# Altium project battery capacity measure.PrjPcb
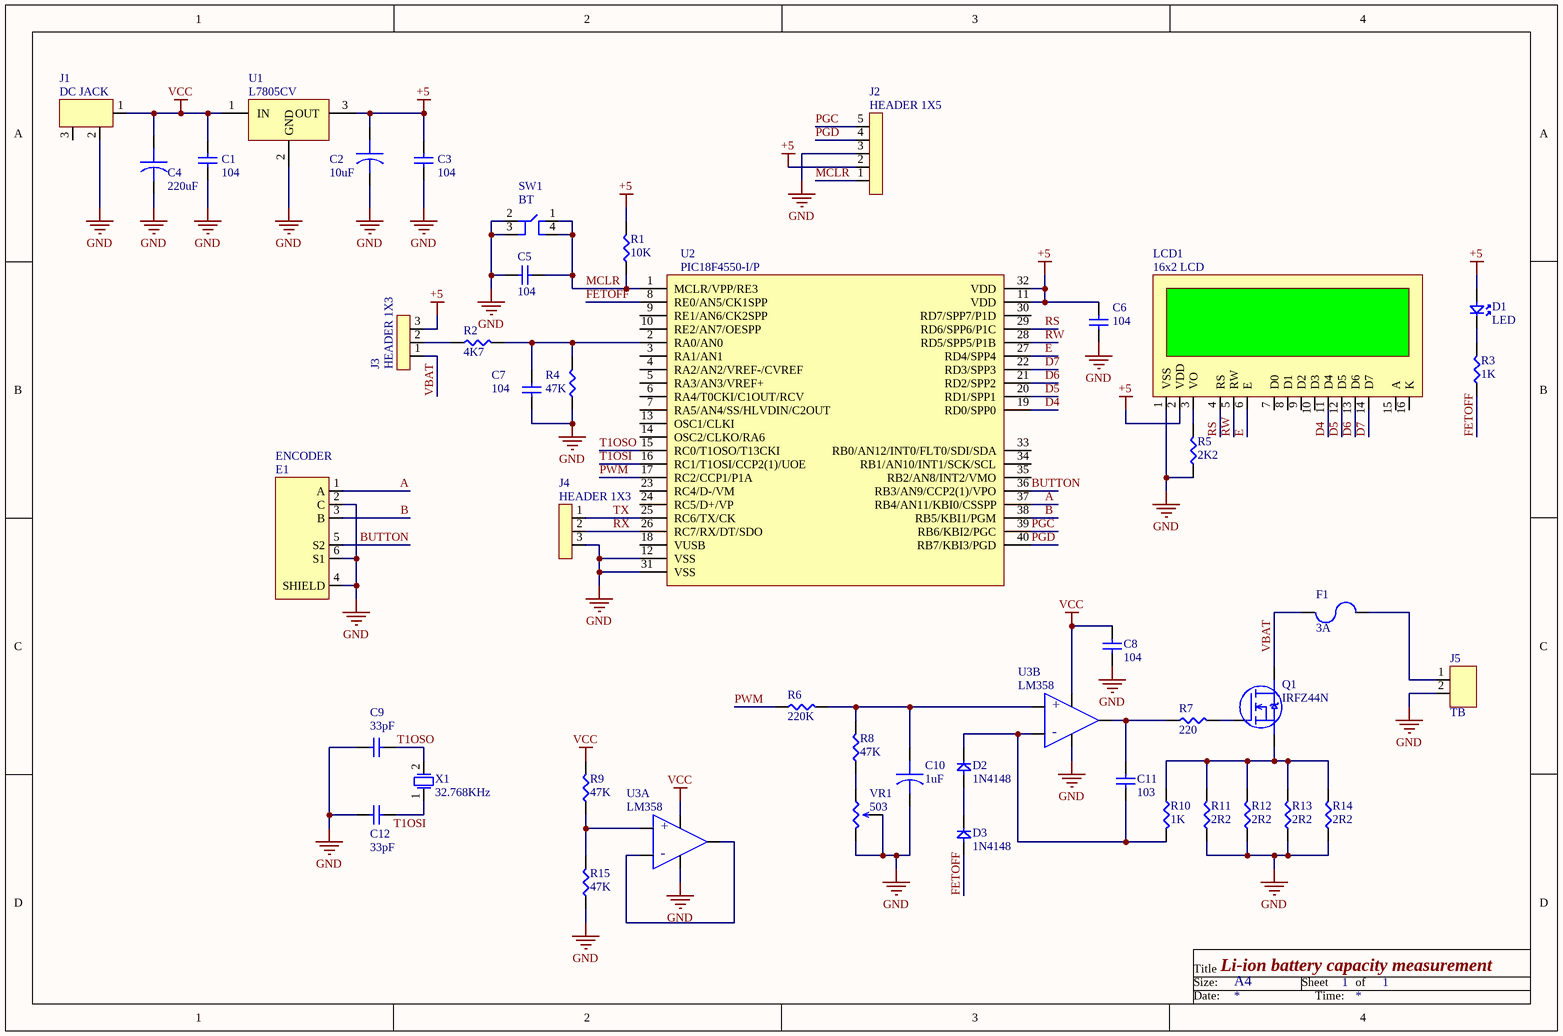
[diagram p0: SCH.SchDoc]
1 sheet, 45 parts. Net scope: global (net labels, ports and power ports of the same name join across sheets).
Board file: PCB.PcbDoc

## Sheet SCH.SchDoc
size A4

### Parts
C1  104  [CAP CER 2.5]
C2  10uF  [CPOL TH 2x5.08mm]
C3  104  [CAP CER 2.5]
C4  220uF  [CPOL TH 3.5x8.01mm]
C5  104  [CAP CER 2.5]
C6  104  [CAP CER 2.5]
C7  104  [CAP CER 2.5]
C8  104  [CAP CER 2.5]
C9  33pF  [CAP CER 2.5]
C10  1uF  [CPOL TH 2x5.08mm]
C11  103  [CAP CER 2.5]
C12  33pF  [CAP CER 2.5]
D1  LED  [LED TH 5MM]
D2  1N4148  [DO-35]
D3  1N4148  [DO-35]
E1  ENCODER  [ENCODER]
F1  3A  [FUSE 5X20MM]
J1  DC JACK  [DC JACK 5MM]
J2  HEADER 1X5  [HEADER 1X5]
J3  HEADER 1X3  [HEADER 1X3]
J4  HEADER 1X3  [HEADER 1X3]
J5  TB  [TBLOCK-I2]
LCD1  16x2 LCD  [16 X 2 LCD]
Q1  IRFZ44N  [TO-220]
R1  10K  [RES TH 1/4W]
R2  4K7  [RES TH 1/4W]
R3  1K  [RES TH 1/4W]
R4  47K  [RES TH 1/4W]
R5  2K2  [RES TH 1/4W]
R6  220K  [RES TH 1/4W]
R7  220  [RES TH 1/4W]
R8  47K  [RES TH 1/4W]
R9  47K  [RES TH 1/4W]
R10  1K  [RES TH 1/4W]
R11  2R2  [RES TH 1W]
R12  2R2  [RES TH 1W]
R13  2R2  [RES TH 1W]
R14  2R2  [RES TH 1W]
R15  47K  [RES TH 1/4W]
SW1  BT  [BUTTON 6X6]
U1  L7805CV  [TO-220]
U2  PIC18F4550-I/P  [DIP 40]
U3  LM358  [DIP 8]  (parts A,B of 2)
VR1  503  [3296W]
X1  32.768KHz  [TUNING FORK]

### Nets
+5: C2.1(+) C3.1 C6.1 D1.1(A) J2.2 J3.3 LCD1.2(VDD) R1.2 U1.3(OUT) U2.11(VDD) U2.32(VDD)
GND: C1.2 C2.2(-) C3.2 C4.2(-) C5.1 C6.2 C7.2 C8.2 C9.1 C10.2(-) C12.1 E1.2(C) E1.4(SHIELD) E1.6(S1) J1.2 J2.3 J4.3 J5.2 LCD1.1(VSS) R4.1 R5.1 R11.1 R12.1 R13.1 R14.1 R15.1 SW1.2 SW1.3 U1.2(GND) U2.12(VSS) U2.31(VSS) U3.4(V-) VR1.2 VR1.3
VCC: C1.1 C4.1(+) C8.1 J1.1 R9.2 U1.1(IN) U3.8(V+)
A: E1.1(A) U2.37(RB4/AN11/KBI0/CSSPP)
B: E1.3(B) U2.38(RB5/KBI1/PGM)
BUTTON: E1.5(S2) U2.36(RB3/AN9/CCP2(1)/VPO)
D4: LCD1.11(D4) U2.19(RD0/SPP0)
D5: LCD1.12(D5) U2.20(RD1/SPP1)
D6: LCD1.13(D6) U2.21(RD2/SPP2)
D7: LCD1.14(D7) U2.22(RD3/SPP3)
E: LCD1.6(E) U2.27(RD4/SPP4)
FETOFF: D3.1(A) R3.1 U2.8(RE0/AN5/CK1SPP)
MCLR: C5.2 J2.1 R1.1 SW1.1 SW1.4 U2.1(MCLR/VPP/RE3)
PGC: J2.5 U2.39(RB6/KBI2/PGC)
PGD: J2.4 U2.40(RB7/KBI3/PGD)
PWM: R6.1 U2.17(RC2/CCP1/P1A)
RS: LCD1.4(RS) U2.29(RD6/SPP6/P1C)
RW: LCD1.5(RW) U2.28(RD5/SPP5/P1B)
RX: J4.2 U2.26(RC7/RX/DT/SDO)
T1OSI: C12.2 U2.16(RC1/T1OSI/CCP2(1)/UOE) X1.1
T1OSO: C9.2 U2.15(RC0/T1OSO/T13CKI) X1.2
TX: J4.1 U2.25(RC6/TX/CK)
VBAT: F1.1 J3.1 Q1.2(D)
NetC7_1: C7.1 R2.2 R4.2 U2.2(RA0/AN0)
NetC10_1: C10.1(+) R6.2 R8.2 U3.5(+INB)
NetC11_1: C11.1 R7.1 U3.7(OUTB)
NetC11_2: C11.2 D2.2(K) R10.2 U3.6(-INB)
NetD1_2: D1.2(K) R3.2
NetD2_1: D2.1(A) D3.2(K)
NetF1_2: F1.2 J5.1
NetJ3_2: J3.2 R2.1
NetLCD1_3: LCD1.3(VO) R5.2
NetQ1_1: Q1.1(G) R7.2
NetQ1_3: Q1.3(S) R10.1 R11.2 R12.2 R13.2 R14.2
NetR8_1: R8.1 VR1.1
NetR9_1: R9.1 R15.2 U3.3(+INA)
NetU3_1: U3.1(OUTA) U3.2(-INA)

Not connected (* = marked no-connect by the designer): J1 3; LCD1 7(D0) 8(D1) 9(D2) 10(D3) 15(A) 16(K); U2 3(RA1/AN1) 4(RA2/AN2/VREF-/CVREF) 5(RA3/AN3/VREF+) 6(RA4/T0CKI/C1OUT/RCV) 7(RA5/AN4/SS/HLVDIN/C2OUT) 9(RE1/AN6/CK2SPP) 10(RE2/AN7/OESPP) 13(OSC1/CLKI) 14(OSC2/CLKO/RA6) 18(VUSB) 23(RC4/D-/VM) 24(RC5/D+/VP) 30(RD7/SPP7/P1D) 33(RB0/AN12/INT0/FLT0/SDI/SDA) 34(RB1/AN10/INT1/SCK/SCL) 35(RB2/AN8/INT2/VMO)

### Notes on the sheet
- Title
- Size:
- Li-ion battery capacity measurement
- A4
- Sheet
- 1
- of
- Date:
- Time:
- (in symbol LM358AN, part A) +; -
- (in symbol LM358AN, part B) +; -

### Library data of the parts
C1 C3 C5-C8 = CAP CER 104: Capacitor;  Ceramic;  Cap 0.1 uF;  Tol -20, +80%;  Vol-Rtg 50 VDC;  Radial;  Y5V; Manufacturer: NTE Electronics; Manufacturer Part Number: 89410; Tolerance: 80%; Capacitance: 100nF; Voltage Rating (DC): 50V; Supplier 1: Newark; RoHS: No; Category: Ceramic Capacitors; Pricing 1: 1=0,23200, 10=0,22300, 25=0,22200, 50=0,22000, 100=0,21300 (USD); Mount: Through Hole; Case/Package: Radial; Min Operating Temperature: -25°C; Max Operating Temperature: 85°C; Termination: Radial; Resistor Type: Ceramic; Lead Pitch: 4.5mm; ComponentLink1URL: https://datasheet.ciiva.com/14590/70232643-14590315.pdf?src-supplier=Allied+Electronics; ComponentLink1Description: https://datasheet.ciiva.com/14590/70232643-14590315.pdf?src-supplier=Allied+Electronics; ComponentLink2URL: https://datasheet.ciiva.com/15915/5989000-15915839.pdf?src-supplier=Onlinecomponents.com; ComponentLink2Description: https://datasheet.ciiva.com/15915/5989000-15915839.pdf?src-supplier=Onlinecomponents.com; Supplier Part Number 1: 33C9034
C2 = CPOL TH 10uF 50V: Aluminum Electrolytic Capacitors - Leaded 50volts 10uF 20%; Manufacturer: KEMET; Manufacturer Part Number: ESH106M050AC3AA; Dielectric Material: Aluminium; Voltage Rating (DC): 50V; Ripple Current: 50mA; Polarity: Polar; Life (Hours): 2000Hour; Leakage Current: 5uA; Dissipation Factor: 12%; Lead Diameter: 0.5mm; Lead Length: 20mm; Supplier 1: Digi-Key; RoHS: Yes; Category: Aluminum Electrolytic Capacitors; Stock 1: 5452; Pricing 1: 1=0,22000, 10=0,14900, 50=0,08960, 100=0,07560, 500=0,05172, 1000=0,04576, 2500=0,04377, 5000=0,03979 (USD); Mount: Through Hole,PCB; Case/Package: Radial; Min Operating Temperature: -40°C; Max Operating Temperature: 105°C; Capacitance: 10uF; Tolerance: 20%; Voltage Rating: 50V; Packaging: Bulk; Package Quantity: 10000; Termination: Radial; Voltage: 50V; Series: ESH; Diameter: 5mm; Length: 11mm; Height: 11mm; Lead Pitch: 2mm; Height - Seated (Max): 0.492inch; Radiation Hardening: No; REACH SVHC: No SVHC; RoHS Compliant: Yes; ComponentLink1URL: https://datasheet.ciiva.com/18447/70233271-18447125.pdf?src-supplier=Allied+Electronics; ComponentLink1Description: https://datasheet.ciiva.com/18447/70233271-18447125.pdf?src-supplier=Allied+Electronics; ComponentLink2URL: https://datasheet.ciiva.com/22620/1794402-22620758.pdf?src-supplier=Element14; ComponentLink2Description: https://datasheet.ciiva.com/22620/1794402-22620758.pdf?src-supplier=Element14; Supplier Part Number 1: 399-6543-ND
C4 = CPOL TH 220uF 25V: Cap Aluminum Lytic 220uF 25V 20% (8 X 11mm) Radial 3.5mm 250mA 2000h 105C Bulk; Manufacturer: KEMET; Manufacturer Part Number: ESH227M025AG3AA; Dielectric Material: Aluminium; Life (Hours): 2000Hour; Leakage Current: 55uA; Dissipation Factor: 16%; Lead Diameter: 0.6mm; Lead Length: 20mm; Supplier 1: Digi-Key; RoHS: Yes; Category: Aluminum Electrolytic Capacitors; Stock 1: 18483; Pricing 1: 1=0,37000, 10=0,25500, 50=0,17020, 100=0,14470, 500=0,10212, 1000=0,08936, 2500=0,08510, 5000=0,07872 (USD); Mount: Through Hole,PCB; Case/Package: Radial; Min Operating Temperature: -40°C; Max Operating Temperature: 105°C; Capacitance: 220uF; Tolerance: 20%; Ripple Current: 250mA; Voltage Rating: 25V; Packaging: Bulk; Voltage Rating (DC): 25V; Package Quantity: 6000; Termination: Radial; Voltage: 25V; Series: ESH; Diameter: 8mm; Length: 11mm; Height: 11mm; Lead Pitch: 3.5mm; Height - Seated (Max): 0.492inch; Radiation Hardening: No; REACH SVHC: No SVHC; RoHS Compliant: Yes; ComponentLink1URL: https://datasheet.ciiva.com/22627/1794402-22627034.pdf?src-supplier=Farnell; ComponentLink1Description: https://datasheet.ciiva.com/22627/1794402-22627034.pdf?src-supplier=Farnell; Supplier Part Number 1: 399-6567-ND
C9 C12 = CAP CER 33pF: CAPACITOR CERAMIC DISC 10000PF 50V 10% RADIAL LEAD; Manufacturer: NTE Electronics; Manufacturer Part Number: 89033; Supplier 1: Onlinecomponents.com; RoHS: No; Category: Ceramic Capacitors; Stock 1: 9; Pricing 1: 80=1,86600, 100=0,80600, 250=0,40800, 500=0,39000 (USD); Mount: Through Hole; Case/Package: Radial; Min Operating Temperature: -25°C; Max Operating Temperature: 85°C; Tolerance: 10%; Capacitance: 33pF; Resistor Type: Ceramic; Lead Pitch: 2.5mm; ComponentLink1URL: https://datasheet.ciiva.com/15915/5989000-15915132.pdf?src-supplier=Onlinecomponents.com; ComponentLink1Description: https://datasheet.ciiva.com/15915/5989000-15915132.pdf?src-supplier=Onlinecomponents.com; Supplier Part Number 1: 89033; Voltage Rating (DC): 50V; ComponentLink2URL: https://datasheet.ciiva.com/15915/5989000-15915161.pdf?src-supplier=Onlinecomponents.com; ComponentLink2Description: https://datasheet.ciiva.com/15915/5989000-15915161.pdf?src-supplier=Onlinecomponents.com
C10 = CPOL TH 1uF 50V: Cap Aluminum 1uF 50V 20% (5 X 11mm) Radial Aluminum Cylindrical Can 2mm 12mA 2000 hr 105°C Bulk; Manufacturer: KEMET; Manufacturer Part Number: ESH105M050AC3AA; Dielectric Material: Aluminium; Leakage Current: 3uA; Dissipation Factor: 12%; Life (Hours): 2000Hour; Lead Diameter: 0.5mm; Lead Length: 20mm; Supplier 1: Newark; RoHS: Yes; Category: Aluminum Electrolytic Capacitors; Stock 1: 8232; Pricing 1: 10=0,15000, 25=0,11900, 50=0,08700, 100=0,07300, 500=0,05200, 1000=0,04400, 2500=0,04200 (USD); Mount: Through Hole,PCB; Case/Package: Radial; Min Operating Temperature: -40°C; Max Operating Temperature: 105°C; Capacitance: 1uF; Tolerance: 20%; Ripple Current: 12mA; Packaging: Bulk; Voltage Rating: 50V; Voltage Rating (DC): 50V; Package Quantity: 10000; Termination: Radial; Voltage: 50V; Series: ESH; Diameter: 5mm; Length: 11mm; Height: 11mm; Lead Pitch: 2mm; Height - Seated (Max): 0.492inch; Radiation Hardening: No; RoHS Compliant: Yes; ComponentLink1URL: https://datasheet.ciiva.com/14609/70233271-14609911.pdf?src-supplier=Allied+Electronics; ComponentLink1Description: https://datasheet.ciiva.com/14609/70233271-14609911.pdf?src-supplier=Allied+Electronics; Supplier Part Number 1: 48AC1666
C11 = CAP CER 103: CAPACITOR CERAMIC DISC 10000PF 50V 10% RADIAL LEAD; Manufacturer: NTE Electronics; Manufacturer Part Number: 89310; Capacitance: 10nF; Supplier 1: Onlinecomponents.com; RoHS: No; Category: Ceramic Capacitors; Stock 1: 7; Pricing 1: 70=2,24380, 100=1,30000, 250=0,48500, 500=0,47300 (USD); Mount: Through Hole; Case/Package: Radial; Min Operating Temperature: -25°C; Max Operating Temperature: 85°C; Tolerance: 10%; Voltage Rating (DC): 50V; Resistor Type: Ceramic; Lead Pitch: 5.1mm; ComponentLink1URL: https://datasheet.ciiva.com/15915/5989000-15915161.pdf?src-supplier=Onlinecomponents.com; ComponentLink1Description: https://datasheet.ciiva.com/15915/5989000-15915161.pdf?src-supplier=Onlinecomponents.com; Supplier Part Number 1: 89310
D1 = LED GREEN 5MM: 5MM Yellow Green Led Lamp; Manufacturer: American Opto Plus; Manufacturer Part Number: L513GD-A; Supplier 1: Interstate Connecting Components; Supplier Part Number 1: 557T071M432ST
D2 D3 = 1N4148: DIODE GEN PURP 100V 200MA DO35; Manufacturer: ON Semiconductor / Fairchild; Forward Voltage: 1V; Polarity: Standard; Capacitance: 4pF; Forward Current: 300mA; Reverse Recovery Time: 4ns; Element Configuration: Single; Peak Non-Repetitive Surge Current: 4A; Max Forward Surge Current (Ifsm): 1A; Max Power Dissipation: 500mW; Max Reverse Current: 5uA; Outside Diameter: 1.85mm; Supplier 1: RSComponents; Manufacturer Part Number: 1N4148; RoHS: Yes; Category: Integrated Circuits (ICs); Stock 1: 106000; Pricing 1: 2000=0,02100, 10000=0,02100 (USD); Mount: Through Hole; Case/Package: DO-35; Number of Pins: 2; Weight: 0.01lb; Contact Plating: Tin,Matte; Min Operating Temperature: -65°C; Max Operating Temperature: 175°C; Packaging: Bulk; Current Rating: 200mA; Output Current: 200mA; Max Repetitive Reverse Voltage (Vrrm): 100V; Voltage Rating (DC): 100V; Voltage: 100V; Current: 4A; Package Quantity: 2000; Average Rectified Current: 200mA; Power Dissipation: 500mW; Max Surge Current: 4A; Recovery Time: 4ns; Max Reverse Voltage (DC): 100V; Reverse Voltage: 100V; Series: -; Diameter: 1.91mm; Length: 4.56mm; Width: 1.91mm; Height: 4.56mm; Radiation Hardening: No; REACH SVHC: No SVHC; Lead Free: Lead Free; RoHS Compliant: Yes; ComponentLink1URL: https://datasheet.ciiva.com/27049/743285-27049708.pdf?src-supplier=Jameco; ComponentLink1Description: https://datasheet.ciiva.com/27049/743285-27049708.pdf?src-supplier=Jameco; ComponentLink2URL: https://datasheet.ciiva.com/1242/1716967-1242233.pdf?src-supplier=Newark; ComponentLink2Description: https://datasheet.ciiva.com/1242/1716967-1242233.pdf?src-supplier=Newark; ComponentLink3URL: https://datasheet.ciiva.com/910/1n914-910546.pdf?src-supplier=Digi-Key; ComponentLink3Description: https://datasheet.ciiva.com/910/1n914-910546.pdf?src-supplier=Digi-Key; ComponentLink4URL: https://datasheet.ciiva.com/3304/fdll914b-3304217.pdf?src-supplier=Avnet; ComponentLink4Description: https://datasheet.ciiva.com/3304/fdll914b-3304217.pdf?src-supplier=Avnet; ComponentLink5URL: https://datasheet.ciiva.com/25951/fdll914b-25951516.pdf?src-supplier=Avnet+Europe; ComponentLink5Description: https://datasheet.ciiva.com/25951/fdll914b-25951516.pdf?src-supplier=Avnet+Europe; Supplier Part Number 1: 8428002
E1 = ENCODER: Mechanical Encoder Rotary Incremental Flat 0.02N.m Straight Quadrature Digital Square Wave 20PPR Through Hole PC Pin; Manufacturer: CUI; Manufacturer Part Number: ACZ11BR4E-15FD1-20C; Output Type: Quadrature,Incremental; Built in Switch: Yes; Pulses per Revolution: 20; Supplier 1: Perfect Parts; RoHS: Yes; Category: Uncategorized; Mount: Through Hole,PCB; Termination: PC Pin; Package Quantity: 1020; Encoder Type: Mechanical; Detent: Yes; Orientation: Vertical; ComponentLink1URL: https://datasheet.ciiva.com/2813/acz11-2813480.pdf?src-supplier=Digi-Key; ComponentLink1Description: https://datasheet.ciiva.com/2813/acz11-2813480.pdf?src-supplier=Digi-Key; Supplier Part Number 1: ACZ11BR4E-15FD1-20C
F1 = FUSE 3A: Fuse Miniature 3A 250V Fast 2-Pin Cartridge Holder; Manufacturer: Bel; Manufacturer Part Number: 5MF3-R; DC Cold Resistance: 30mR; Power Dissipation: 590mW; Fuse Type: Cartridge, Glass; Approvals: CSA,CE,cULus,PSE; Supplier 1: Newark; RoHS: Yes; Category: Fuses; Stock 1: 239; Pricing 1: 1=0,27000, 10=0,26000, 25=0,24600, 50=0,23200, 100=0,21600, 500=0,16000 (USD); Mount: Holder,Surface Mount; Number of Pins: 2; Contact Plating: Nickel; Housing Material: Glass; Min Operating Temperature: -55°C; Max Operating Temperature: 125°C; Current Rating: 3A; Voltage Rating (AC): 250V; Packaging: Bulk; Voltage Rating: 250V; Voltage Rating (DC): 250V; Series: 5MF; Diameter: 5.1mm; Length: 20mm; Radiation Hardening: No; Lead Free: Lead Free; RoHS Compliant: Yes; ComponentLink1URL: https://datasheet.ciiva.com/300/5mf-300807.pdf?src-supplier=Digi-Key; ComponentLink1Description: https://datasheet.ciiva.com/300/5mf-300807.pdf?src-supplier=Digi-Key; ComponentLink2URL: https://datasheet.ciiva.com/8267/5mf-8267706.pdf?src-supplier=Avnet; ComponentLink2Description: https://datasheet.ciiva.com/8267/5mf-8267706.pdf?src-supplier=Avnet; ComponentLink3URL: https://datasheet.ciiva.com/15187/getdatasheetpartid-207224-15187530.pdf?src-supplier=Verical; ComponentLink3Description: https://datasheet.ciiva.com/15187/getdatasheetpartid-207224-15187530.pdf?src-supplier=Verical; Supplier Part Number 1: 49AC2961
J1 = DC JACK 5MM: Conn Power PIN 2 POS Solder RA Thru-Hole 3 Terminal 1 Port; Manufacturer: Kycon; Manufacturer Part Number: KLDX-0202-A; Gender: Female; Current Rating: 3.5A; Voltage Rating: 24V; Insulation Resistance: 100MR; Number of Contacts: 2; Supplier 1: Digi-Key; RoHS: Yes; Category: Connectors; Stock 1: 17817; Pricing 1: 1=0,68000, 10=0,58900, 25=0,53800, 50=0,50640, 100=0,48530, 250=0,44312, 500=0,42200, 1000=0,34815, 2500=0,31650 (USD); Mount: Through Hole; Color: Black; Contact Material: Brass; Contact Plating: Tin; Housing Material: PBT; Min Operating Temperature: -25°C; Max Operating Temperature: 85°C; Contact Gender: Female; Package Quantity: 500; Packaging: Bag; Connector Type: Power; Termination: Solder; Orientation: Right Angle; Voltage Rating (DC): 24V; Series: KLDX; Radiation Hardening: No; Flammability Rating: UL94 V-0; RoHS Compliant: Yes; ComponentLink1URL: http://www.mouser.com/ds/2/222/KLDX_0202_LT-334784.pdf?src-supplier=Mouser; ComponentLink1Description: http://www.mouser.com/ds/2/222/KLDX_0202_LT-334784.pdf?src-supplier=Mouser; ComponentLink2URL: http://domino2.kycon.com/catalog_PDF/KLDX_0202.pdf?src-supplier=Avnet; ComponentLink2Description: http://domino2.kycon.com/catalog_PDF/KLDX_0202.pdf?src-supplier=Avnet; ComponentLink3URL: http://domino2.kycon.com/catalog_PDF/KLDX_0202.pdf?src-supplier=Avnet+Europe; ComponentLink3Description: http://domino2.kycon.com/catalog_PDF/KLDX_0202.pdf?src-supplier=Avnet+Europe; Supplier Part Number 1: 2092-KLDX-0202-A-ND
J2 = HEADER 1X5: Headers & Wire Housings Classic PCB Header Strips, 0.100 pitch; Manufacturer: Samtec; Manufacturer Part Number: TSW-105-23-T-S; Number of Positions: 5; Gender: Male; Connector Type: Male Pin; Max Current Rating: 7.6A; Max Voltage Rating (AC): 550V; Pitch: 2.54mm; Supplier 1: RSComponents; RoHS: Yes; Category: Connectors; Stock 1: 477; Pricing 1: 1=0,10000 (GBP); Mount: Through Hole; Contact Plating: Tin; Color: Black; Contact Material: Bronze; Housing Color: Black; Housing Material: Polyester; Min Operating Temperature: -55°C; Max Operating Temperature: 105°C; Number of Rows: 1; Packaging: Bulk; Termination: Solder; Number of Contacts: 5; Series: TSW; Contact Type: Male Pin; Package Quantity: 1; Orientation: Straight; Length: 12.7mm; Width: 2.54mm; Contact Mating Length: 0.23inch; Depth: 2.54mm; Radiation Hardening: No; RoHS Compliant: Yes; REACH SVHC: No SVHC; Lead Free: Lead Free; ComponentLink1URL: https://datasheet.ciiva.com/29947/htsw-th-29947931.pdf?src-supplier=Avnet; ComponentLink1Description: https://datasheet.ciiva.com/29947/htsw-th-29947931.pdf?src-supplier=Avnet; ComponentLink2URL: https://datasheet.ciiva.com/6889/tsw-xxx-xx-xxx-x-xx-xxx-mkt-6889310.pdf?src-supplier=Digi-Key; ComponentLink2Description: https://datasheet.ciiva.com/6889/tsw-xxx-xx-xxx-x-xx-xxx-mkt-6889310.pdf?src-supplier=Digi-Key; Supplier Part Number 1: 2001745
J3 J4 = HEADER 1X3: Conn Unshrouded Header HDR 3 POS 2.54mm Solder ST Top Entry Thru-Hole Bag; Manufacturer: Samtec; Manufacturer Part Number: TSW-103-23-T-S; Number of Positions: 3; Gender: Male; Connector Type: Male Pin; Max Current Rating: 7.6A; Max Voltage Rating (AC): 550V; Supplier 1: RSComponents; RoHS: Yes; Category: Connectors; Stock 1: 1; Pricing 1: 3580=0,11300 (USD); Mount: Through Hole; Color: Black; Contact Plating: Tin; Contact Material: Bronze; Housing Color: Black; Housing Material: Polyester; Min Operating Temperature: -55°C; Max Operating Temperature: 105°C; Number of Rows: 1; Packaging: Bulk; Termination: Solder; Number of Contacts: 3; Orientation: Straight; Series: TSW; Contact Type: Male Pin; Length: 7.62mm; Width: 2.54mm; Pitch: 2.54mm; Contact Mating Length: 0.23inch; Depth: 2.54mm; Radiation Hardening: No; Lead Free: Lead Free; REACH SVHC: No SVHC; RoHS Compliant: Yes; ComponentLink1URL: https://datasheet.ciiva.com/16733/htsw-th-16733832.pdf?src-supplier=Avnet+Europe; ComponentLink1Description: https://datasheet.ciiva.com/16733/htsw-th-16733832.pdf?src-supplier=Avnet+Europe; ComponentLink2URL: https://datasheet.ciiva.com/6859/tsw-xxx-xx-xxx-x-xx-xxx-mkt-6859432.pdf?src-supplier=Digi-Key; ComponentLink2Description: https://datasheet.ciiva.com/6859/tsw-xxx-xx-xxx-x-xx-xxx-mkt-6859432.pdf?src-supplier=Digi-Key; ComponentLink3URL: https://datasheet.ciiva.com/48561/htsw-th-48561439.pdf?src-supplier=Avnet; ComponentLink3Description: https://datasheet.ciiva.com/48561/htsw-th-48561439.pdf?src-supplier=Avnet; Supplier Part Number 1: 1801192
J5 = TERMINAL2: Serie 2165 S - 5.08 mm Horizontal Entry Modular with Rising Cage Clamp WR-TBL, 2 pin; Manufacturer: Wurth Electronics; Manufacturer Part Number: 691216510002S; Supplier 1: RSComponents; RoHS: Yes; Category: Terminal Blocks; Stock 1: 660; Pricing 1: 15=0,77000, 50=0,65600, 100=0,60000 (GBP); Housing Material: Nylon; RoHS Compliant: Yes; Supplier Part Number 1: 1910248P
LCD1 = LCD 16X2: Manufacturer: Matrix Orbital; Manufacturer Part Number: MOP-AL162A-BYFY-25J-3IN; Interface: Parallel,8 bit; Number of Characters: 32; Backlight Type: LED; Supplier 1: Digi-Key; RoHS: No; Stock 1: 1226; Pricing 1: 1=9,53000, 25=8,99000, 50=8,64000, 100=8,24000, 200=7,81005, 500=7,53004, 1000=7,43003 (USD); Min Operating Temperature: -20°C; Max Operating Temperature: 70°C; ComponentLink1URL: https://www.matrixorbital.com/index.php?route=extension/module/product_downloads/get&amp;did=227&src-supplier=Digi-Key; ComponentLink1Description: https://www.matrixorbital.com/index.php?route=extension/module/product_downloads/get&amp;did=227&src-supplier=Digi-Key; Supplier Part Number 1: 635-1205-ND
Q1 = IRFZ44NPBF: N沟道 VDS=55V VGS=±20V ID=49A; Manufacturer: Infineon; Continuous Drain Current (ID): 49A; Gate to Source Voltage (Vgs): 20V; Rise Time: 60ns; Power Dissipation: 94W; Turn-Off Delay Time: 44ns; Turn-On Delay Time: 12ns; Drain to Source Voltage (Vdss): 55V; Rds On Max: 17.5mR; Input Capacitance: 1.47nF; Threshold Voltage: 4V; Element Configuration: Single; Supplier 1: Newark; Manufacturer Part Number: IRFZ44NPBF; RoHS: Yes; Category: MOSFETs; Stock 1: 13763; Pricing 1: 1=1,19000, 10=1,03000, 100=0,80800, 500=0,72200, 1000=0,58400 (USD); Mount: Through Hole; Case/Package: TO-220; Number of Pins: 3; Contact Plating: Tin,Matte; Min Operating Temperature: -55°C; Max Operating Temperature: 175°C; Packaging: Rail/Tube; Max Power Dissipation: 94W; Drain to Source Resistance: 17.5mR; Drain to Source Breakdown Voltage: 55V; Max Dual Supply Voltage: 55V; Length: 0.42inch; Width: 0.19inch; Height: 0.65inch; REACH SVHC: No SVHC; Lead Free: Lead Free; RoHS Compliant: Yes; Halogen Free: Halogen Free; ComponentLink1URL: https://www.alliedelec.com/m/d/ec90d67249a68ee89112b87fffe18402.pdf?src-supplier=Allied+Electronics; ComponentLink1Description: https://www.alliedelec.com/m/d/ec90d67249a68ee89112b87fffe18402.pdf?src-supplier=Allied+Electronics; ComponentLink2URL: http://www.farnell.com/datasheets/1916237.pdf?src-supplier=Element14; ComponentLink2Description: http://www.farnell.com/datasheets/1916237.pdf?src-supplier=Element14; ComponentLink3URL: http://www.irf.com/product-info/datasheets/data/irfz44nspbf.pdf?src-supplier=Avnet+Asia; ComponentLink3Description: http://www.irf.com/product-info/datasheets/data/irfz44nspbf.pdf?src-supplier=Avnet+Asia; ComponentLink4URL: https://www.infineon.com/dgdl/irfz44npbf.pdf?fileId=5546d462533600a40153563b3a9f220d&src-supplier=Digi-Key; ComponentLink4Description: https://www.infineon.com/dgdl/irfz44npbf.pdf?fileId=5546d462533600a40153563b3a9f220d&src-supplier=Digi-Key; Supplier Part Number 1: 63J7131
R1 = RES TH 10K 1/4W: 直插电阻 碳膜 10KΩ ±5% 1/4W -350/+500ppm/°C; Manufacturer: Yageo; Manufacturer Part Number: CFR-25JB-52-10K; Resistance: 10kR; Max Power Dissipation: 250mW; Supplier 1: Digi-Key; RoHS: Yes; Category: Through-Hole Resistors; Stock 1: 22856; Pricing 1: 1=0,10000, 10=0,06800, 25=0,04680, 50=0,03640, 100=0,02600, 250=0,02028, 500=0,01612, 1000=0,01144, 5000=0,00884 (USD); Case/Package: Axial; Min Operating Temperature: -55°C; Max Operating Temperature: 155°C; Package Quantity: 200; Packaging: Bulk; Tolerance: 5%; Resistor Type: Carbon Film; Temperature Coefficient: 500ppm/°C; Number of Terminations: 2; Series: Carbon Film; Length: 0.248inch; RoHS Compliant: Yes; Lead Free: Lead Free; ComponentLink1URL: http://components.arrow.com/part/dataview/0323_07021247?src-supplier=Arrow+Europe; ComponentLink1Description: http://components.arrow.com/part/dataview/0323_07021247?src-supplier=Arrow+Europe; ComponentLink2URL: http://www.yageo.com/NewPortal/yageodocoutput?fileName=/pdf/throughhole/Yageo_LR_CFR_2013.pdf&src-supplier=Digi-Key; ComponentLink2Description: http://www.yageo.com/NewPortal/yageodocoutput?fileName=/pdf/throughhole/Yageo_LR_CFR_2013.pdf&src-supplier=Digi-Key; Supplier Part Number 1: 10KQBK-ND
R2 = RES TH 4K7 1/4W: General Type Carbon Film Resistor 4.7kOhm 1/4W 5% Axial Bulk; Manufacturer: Yageo; Manufacturer Part Number: CFR-25JB-52-4K7; Resistance: 4.7kR; Power Rating: 250mW; Temperature Coefficient: 500ppm/°C; Supplier 1: Mouser; RoHS: Yes; Category: Through-Hole Resistors; Stock 1: 22004; Pricing 1: 1=0,10000, 10=0,06700, 50=0,04700, 100=0,02600, 1000=0,01200, 10000=0,00900 (USD); Case/Package: Axial; Min Operating Temperature: -55°C; Max Operating Temperature: 155°C; Tolerance: 5%; Package Quantity: 200; Packaging: Bulk; Resistor Type: Carbon Film; Number of Terminations: 2; Max Power Dissipation: 250mW; Series: Carbon Film; Length: 0.248inch; Lead Free: Lead Free; RoHS Compliant: Yes; ComponentLink1URL: http://www.yageo.com/NewPortal/yageodocoutput?fileName=/pdf/throughhole/Yageo_LR_CFR_2013.pdf&src-supplier=Digi-Key; ComponentLink1Description: http://www.yageo.com/NewPortal/yageodocoutput?fileName=/pdf/throughhole/Yageo_LR_CFR_2013.pdf&src-supplier=Digi-Key; ComponentLink2URL: http://www.yageo.com/documents/recent/General%20Type_CFR.pdf?src-supplier=Future+Electronics; ComponentLink2Description: http://www.yageo.com/documents/recent/General%20Type_CFR.pdf?src-supplier=Future+Electronics; Supplier Part Number 1: 603-CFR-25JB-52-4K7
R3 R10 = RES TH 1K 1/4W: Res Carbon Film 1K Ohm 5% 1/4W -350ppm/°C to 350ppm/°C Conformal AXL Thru-Hole Bulk; Manufacturer: Yageo; Manufacturer Part Number: CFR-25JB-52-1K; Resistance: 1kR; Temperature Coefficient: 500ppm/°C; Max Power Dissipation: 250mW; Supplier 1: Digi-Key; RoHS: Yes; Category: Through-Hole Resistors; Stock 1: 114185; Pricing 1: 1=0,10000, 10=0,06800, 25=0,04680, 50=0,03640, 100=0,02600, 250=0,02028, 500=0,01612, 1000=0,01144, 5000=0,00884 (USD); Case/Package: Axial; Min Operating Temperature: -55°C; Max Operating Temperature: 155°C; Tolerance: 5%; Package Quantity: 200; Packaging: Bulk; Resistor Type: Carbon Film; Number of Terminations: 2; Series: Carbon Film; Power Rating: 250mW; Length: 0.248inch; RoHS Compliant: Yes; Lead Free: Lead Free; ComponentLink1URL: http://www.yageo.com/NewPortal/yageodocoutput?fileName=/pdf/throughhole/Yageo_LR_CFR_2013.pdf&src-supplier=Digi-Key; ComponentLink1Description: http://www.yageo.com/NewPortal/yageodocoutput?fileName=/pdf/throughhole/Yageo_LR_CFR_2013.pdf&src-supplier=Digi-Key; ComponentLink2URL: http://www.yageo.com/documents/recent/General%20Type_CFR.pdf?src-supplier=Future+Electronics; ComponentLink2Description: http://www.yageo.com/documents/recent/General%20Type_CFR.pdf?src-supplier=Future+Electronics; Supplier Part Number 1: 1.0KQBK-ND
R4 R8 R9 R15 = RES TH 47K 1/4W: General Type Carbon Film Resistor 47kOhm 1/4W 5% Axial Bulk; Manufacturer: Yageo; Manufacturer Part Number: CFR-25JB-52-47K; Resistance: 47kR; Power Rating: 250mW; Temperature Coefficient: 500ppm/°C; Supplier 1: Digi-Key; RoHS: Yes; Category: Through-Hole Resistors; Stock 1: 14143; Pricing 1: 1=0,10000, 10=0,06800, 25=0,04680, 50=0,03640, 100=0,02600, 250=0,02028, 500=0,01612, 1000=0,01144, 5000=0,00884 (USD); Case/Package: Axial; Min Operating Temperature: -55°C; Max Operating Temperature: 155°C; Tolerance: 5%; Package Quantity: 200; Packaging: Bulk; Resistor Type: Carbon Film; Number of Terminations: 2; Max Power Dissipation: 250mW; Series: Carbon Film; Length: 0.248inch; Lead Free: Lead Free; RoHS Compliant: Yes; ComponentLink1URL: http://www.yageo.com/documents/recent/General%20Type_CFR.pdf?src-supplier=Future+Electronics; ComponentLink1Description: http://www.yageo.com/documents/recent/General%20Type_CFR.pdf?src-supplier=Future+Electronics; ComponentLink2URL: http://www.yageo.com/NewPortal/yageodocoutput?fileName=/pdf/throughhole/Yageo_LR_CFR_2013.pdf&src-supplier=Digi-Key; ComponentLink2Description: http://www.yageo.com/NewPortal/yageodocoutput?fileName=/pdf/throughhole/Yageo_LR_CFR_2013.pdf&src-supplier=Digi-Key; Supplier Part Number 1: 47KQBK-ND
R5 = RES TH 2K2 1/4W: Res Carbon Film 2.2K Ohm 5% 1/4W -350 to 500ppm/°C Conformal Axial Thru-Hole Bulk; Manufacturer: Yageo; Manufacturer Part Number: CFR-25JB-52-2K2; Resistance: 2.2kR; Max Power Dissipation: 250mW; Supplier 1: TTI; RoHS: Yes; Category: Through-Hole Resistors; Stock 1: 10000; Pricing 1: 10000=0,00711 (USD); Mount: Through Hole; Case/Package: Axial; Min Operating Temperature: -55°C; Max Operating Temperature: 155°C; Package Quantity: 200; Packaging: Bulk; Tolerance: 5%; Resistor Type: Carbon Film; Temperature Coefficient: 500ppm/°C; Number of Terminations: 2; Series: Carbon Film; Length: 0.248inch; RoHS Compliant: Yes; Lead Free: Lead Free; ComponentLink1URL: http://www.yageo.com/NewPortal/yageodocoutput?fileName=/pdf/throughhole/Yageo_LR_CFR_2013.pdf&src-supplier=Digi-Key; ComponentLink1Description: http://www.yageo.com/NewPortal/yageodocoutput?fileName=/pdf/throughhole/Yageo_LR_CFR_2013.pdf&src-supplier=Digi-Key; Supplier Part Number 1: CFR-25JB-52-2K2
R6 = RES TH 220K 1/4W: General Type Carbon Film Resistor 220kOhm 1/4W 5% Axial Bulk; Manufacturer: Yageo; Manufacturer Part Number: CFR-25JB-52-220K; Resistance: 220kR; Temperature Coefficient: -700ppm/°C; Max Power Dissipation: 250mW; Supplier 1: Digi-Key; RoHS: Yes; Category: Through-Hole Resistors; Stock 1: 15795; Pricing 1: 1=0,10000, 10=0,06800, 25=0,04680, 50=0,03640, 100=0,02600, 250=0,02028, 500=0,01612, 1000=0,01144, 5000=0,00884 (USD); Case/Package: Axial; Min Operating Temperature: -55°C; Max Operating Temperature: 155°C; Package Quantity: 200; Packaging: Bulk; Tolerance: 5%; Resistor Type: Carbon Film; Number of Terminations: 2; Series: Carbon Film; Length: 0.248inch; Lead Free: Lead Free; RoHS Compliant: Yes; ComponentLink1URL: http://www.yageo.com/NewPortal/yageodocoutput?fileName=/pdf/throughhole/Yageo_LR_CFR_2013.pdf&src-supplier=Digi-Key; ComponentLink1Description: http://www.yageo.com/NewPortal/yageodocoutput?fileName=/pdf/throughhole/Yageo_LR_CFR_2013.pdf&src-supplier=Digi-Key; Supplier Part Number 1: 220KQBK-ND
R7 = RES TH 220 1/4W: General Type Carbon Film Resistor 220Ohm 1/4W 5% Axial Bulk; Manufacturer: Yageo; Manufacturer Part Number: CFR-25JB-52-220R; Resistance: 220R; Temperature Coefficient: 500ppm/°C; Max Power Dissipation: 250mW; Supplier 1: Digi-Key; RoHS: Yes; Category: Through-Hole Resistors; Stock 1: 29546; Pricing 1: 1=0,10000, 10=0,06800, 25=0,04680, 50=0,03640, 100=0,02600, 250=0,02028, 500=0,01612, 1000=0,01144, 5000=0,00884 (USD); Case/Package: Axial; Min Operating Temperature: -55°C; Max Operating Temperature: 155°C; Package Quantity: 200; Packaging: Bulk; Tolerance: 5%; Resistor Type: Carbon Film; Number of Terminations: 2; Series: Carbon Film; Length: 0.248inch; RoHS Compliant: Yes; ComponentLink1URL: http://www.mouser.com/ds/2/447/Yageo%20LR_CFR_2013-540723.pdf?src-supplier=Mouser; ComponentLink1Description: http://www.mouser.com/ds/2/447/Yageo%20LR_CFR_2013-540723.pdf?src-supplier=Mouser; ComponentLink2URL: http://www.yageo.com/NewPortal/yageodocoutput?fileName=/pdf/throughhole/Yageo_LR_CFR_2013.pdf&src-supplier=Digi-Key; ComponentLink2Description: http://www.yageo.com/NewPortal/yageodocoutput?fileName=/pdf/throughhole/Yageo_LR_CFR_2013.pdf&src-supplier=Digi-Key; Supplier Part Number 1: 220QBK-ND
R11-R14 = RES TH 2R2 1W: General Type Wirewound Resistor 2.2Ohm 1W 5% Axial T/R; Manufacturer: Yageo; Manufacturer Part Number: KNP100JR-73-2R2; Resistance: 2.2R; Temperature Coefficient: 300ppm/°C; Supplier 1: Mouser; RoHS: No; Category: Through-Hole Resistors; Stock 1: 5441; Pricing 1: 1=0,47000, 10=0,33400, 25=0,24700, 50=0,24700, 100=0,13400, 250=0,11100, 500=0,09100, 1000=0,06600, 2000=0,06000, 4000=0,05800, 10000=0,05800 (USD); Min Operating Temperature: -40°C; Max Operating Temperature: 200°C; Packaging: Tape and Reel; Power Rating: 1W; Termination: Axial; ComponentLink1URL: http://www.mouser.com/ds/2/447/Yageo%20LR_KNP_2013-594556.pdf?src-supplier=Mouser; ComponentLink1Description: http://www.mouser.com/ds/2/447/Yageo%20LR_KNP_2013-594556.pdf?src-supplier=Mouser; Supplier Part Number 1: 603-KNP100JR-73-2R2; Mount: Through Hole
SW1 = BUTTON 6X6: Switch Tactile N.O SPST Round Button PC Pins 0.05A 12VDC 100000Cycle 1.27N Thru-Hole Bulk; Manufacturer: ITT C&K; Manufacturer Part Number: Y97HT21A1GAFP; Mechanical Life: 100000Cycles; Actuator Material: Nylon,Polyamide; Operating Force: 130gf; Illumination Type: Non-Illuminated; Max Voltage Rating (DC): 12V; Switch Function: Off-Mom; Actuator Type: Standard; Supplier 1: Digi-Key; RoHS: Yes; Category: Tactile Switches; Stock 1: 23479; Pricing 1: 1=0,17000, 10=0,16800, 25=0,15880, 100=0,14440, 250=0,13580, 500=0,12422, 1000=0,10400, 2500=0,10112, 5000=0,09534 (USD); Mount: Through Hole; Contact Plating: Silver; Contact Material: Bronze; Min Operating Temperature: -20°C; Max Operating Temperature: 60°C; Packaging: Bulk; Throw Configuration: SPST; Termination: PC Pin; Package Quantity: 1000; Radiation Hardening: No; ComponentLink1URL: http://www.onlinecomponents.com/productFiles/mf-CK/Y96G111J0FPLFS_C&KComponents.pdf?src-supplier=Onlinecomponents.com; ComponentLink1Description: http://www.onlinecomponents.com/productFiles/mf-CK/Y96G111J0FPLFS_C&KComponents.pdf?src-supplier=Onlinecomponents.com; ComponentLink2URL: http://www.ck-components.com/14409/pts645_25apr13.pdf/?src-supplier=Avnet; ComponentLink2Description: http://www.ck-components.com/14409/pts645_25apr13.pdf/?src-supplier=Avnet; Supplier Part Number 1: CKN9071-ND
U1 = L7805CV: Positive Voltage Regulator
U2 = PIC18F4550-I/P: MICROCHIP - PIC18F4550-I/P - 8 Bit Microcontroller, Flash, PIC18F4xxx, 48 MHz, 32 KB, 2 KB, 40, DIP RoHS Compliant: Yes; Core Architecture: PIC; Interface: I2C,SPI,USB,UART,USART; Data Bus Width: 8b; Max Power Dissipation: 1W; Number of Timers/Counters: 4; RAM Size: 2KB; Max Supply Voltage: 5.5V; Min Supply Voltage: 4.2V; Frequency: 48MHz; Number of Programmable I/O: 35; Memory Size: 32KB; Peripherals: PWM,I2C,Brown-out Detect/Reset,POR,WDT,HLVD; Number of Bits: 8; Oscillator Type: Internal; Number of ADC Channels: 13; Number of UART Channels: 1; Access Time: 48us; Number of PWM Channels: 5; Nominal Supply Current: 1.1mA; Supplier 1: Digi-Key; Manufacturer: Microchip; RoHS: Yes; Category: Microprocessors; Stock 1: 127; Pricing 1: 1=5,16000 (USD); Mount: Through Hole; Case/Package: PDIP; Number of Pins: 40; Weight: 0.05lb; Min Operating Temperature: -40°C; Max Operating Temperature: 85°C; Package Quantity: 10; Packaging: Rail/Tube; Max Frequency: 48MHz; Memory Type: FLASH; Watchdog Timer: Yes; Number of I/Os: 35; Number of SPI Channels: 1; Number of I2C Channels: 1; Density: 32KB; Number of A/D Converters: 1; Address Bus Width: 8b; Length: 53.21mm; Width: 0.58inch; Height: 0.195inch; Radiation Hardening: No; Lead Free: Lead Free; REACH SVHC: No SVHC; ComponentLink1URL: https://datasheet.ciiva.com/19471/2177678-19471492.pdf?src-supplier=Jameco; ComponentLink1Description: https://datasheet.ciiva.com/19471/2177678-19471492.pdf?src-supplier=Jameco; ComponentLink2URL: https://datasheet.ciiva.com/26816/pic18f4550-i-p-26816637.pdf?src-supplier=IIIC; ComponentLink2Description: https://datasheet.ciiva.com/26816/pic18f4550-i-p-26816637.pdf?src-supplier=IIIC; ComponentLink3URL: https://datasheet.ciiva.com/16362/filehandler-aspxddocname-en020587-16362390.pdf?src-supplier=Future+Electronics; ComponentLink3Description: https://datasheet.ciiva.com/16362/filehandler-aspxddocname-en020587-16362390.pdf?src-supplier=Future+Electronics; ComponentLink4URL: https://datasheet.ciiva.com/1494/39632e-1494503.pdf?src-supplier=Digi-Key; ComponentLink4Description: https://datasheet.ciiva.com/1494/39632e-1494503.pdf?src-supplier=Digi-Key; ComponentLink5URL: https://datasheet.ciiva.com/9244/39632d-9244680.pdf?src-supplier=Avnet; ComponentLink5Description: https://datasheet.ciiva.com/9244/39632d-9244680.pdf?src-supplier=Avnet; ComponentLink6URL: https://datasheet.ciiva.com/7181/720550-7181018.pdf?src-supplier=Newark; ComponentLink6Description: https://datasheet.ciiva.com/7181/720550-7181018.pdf?src-supplier=Newark; ComponentLink7URL: https://datasheet.ciiva.com/18404/70045698-18404428.pdf?src-supplier=Allied+Electronics; ComponentLink7Description: https://datasheet.ciiva.com/18404/70045698-18404428.pdf?src-supplier=Allied+Electronics; ComponentLink8URL: https://datasheet.ciiva.com/29330/651708-da-01-en-ic-pic-mcu-pic18f4550-i-p-dip-40-mcp-29330715.pdf?src-supplier=Conrad; ComponentLink8Description: https://datasheet.ciiva.com/29330/651708-da-01-en-ic-pic-mcu-pic18f4550-i-p-dip-40-mcp-29330715.pdf?src-supplier=Conrad; Supplier Part Number 1: PIC18F4550-I/P-ND; Manufacturer Part Number: PIC18F4550-I/P
U3 = LM358AN: Op-amp; Low Power; 32 V; 0.5 ma (typ.); 32 V; 2 Mv (typ.); 5 Na (typ.); 0 Degc; Manufacturer: TI National Semiconductor; Manufacturer Part Number: LM358AN/NOPB; Unity Gain Bandwidth Product: 1MHz; Slew Rate: 0.1V/µs; Common Mode Rejection Ratio: 65dB; Max Supply Voltage: 32V; Min Supply Voltage: 3V; Min Dual Supply Voltage: 1.5V; Max Dual Supply Voltage: 16V; Voltage Gain: 100dB; Number of Channels: 2; Output Current: 30mA; Nominal Supply Current: 500uA; Input Offset Voltage (Vos): 3mV; Input Bias Current: 100nA; Operating Supply Current: 1mA; Output Current per Channel: 40mA; Power Dissipation: 830mW; Output Type: PUSH-PULL; Amplifier Type: GENERAL PURPOSE; Supplier 1: Digi-Key; RoHS: Yes; Category: Amplifiers - Op Amps, Buffer, Instrumentation; Stock 1: 1513; Pricing 1: 1=1,13000, 10=1,01000, 25=0,95880, 100=0,78760, 250=0,73624, 500=0,65062, 1000=0,56534 (USD); Mount: Through Hole; Case/Package: PDIP; Number of Pins: 8; Weight: 0.01lb; Contact Plating: Tin,Matte; Min Operating Temperature: 0°C; Max Operating Temperature: 70°C; Packaging: Rail/Tube; Package Quantity: 40; Operating Supply Voltage: 16V; Gain Bandwidth Product: 1MHz; Number of Circuits: 2; Number of Elements: 2; Power Supply Rejection Ratio (PSRR): 65dB; Max Power Dissipation: 830mW; Supply Current: 500uA; Technology: BIPOLAR; Length: 10.16mm; Width: 6.6mm; Height: 5.08mm; Radiation Hardening: No; Lead Free: Lead Free; RoHS Compliant: Yes; ComponentLink1URL: https://datasheet.ciiva.com/25629/0900766b810fa2ed-25629336.pdf?src-supplier=RSComponents; ComponentLink1Description: https://datasheet.ciiva.com/25629/0900766b810fa2ed-25629336.pdf?src-supplier=RSComponents; ComponentLink2URL: https://datasheet.ciiva.com/15130/getdatasheetpartid-55400-15130028.pdf?src-supplier=Verical; ComponentLink2Description: https://datasheet.ciiva.com/15130/getdatasheetpartid-55400-15130028.pdf?src-supplier=Verical; ComponentLink3URL: https://datasheet.ciiva.com/27050/839332-27050318.pdf?src-supplier=Jameco; ComponentLink3Description: https://datasheet.ciiva.com/27050/839332-27050318.pdf?src-supplier=Jameco; ComponentLink4URL: https://datasheet.ciiva.com/26848/lm358an-nopb-26848113.pdf?src-supplier=IIIC; ComponentLink4Description: https://datasheet.ciiva.com/26848/lm358an-nopb-26848113.pdf?src-supplier=IIIC; ComponentLink5URL: https://datasheet.ciiva.com/2973/lm2904-n-2973378.pdf?src-supplier=Avnet; ComponentLink5Description: https://datasheet.ciiva.com/2973/lm2904-n-2973378.pdf?src-supplier=Avnet; ComponentLink6URL: https://datasheet.ciiva.com/6627/lm158-n-6627642.pdf?src-supplier=Digi-Key; ComponentLink6Description: https://datasheet.ciiva.com/6627/lm158-n-6627642.pdf?src-supplier=Digi-Key; ComponentLink7URL: https://datasheet.ciiva.com/14151/ohlmx58-lm2904-e-14151403.pdf?src-supplier=Distrelec; ComponentLink7Description: https://datasheet.ciiva.com/14151/ohlmx58-lm2904-e-14151403.pdf?src-supplier=Distrelec; Supplier Part Number 1: LM358ANNS/NOPB-ND
VR1 = VR 3296W 503: Res Cermet Trimmer 50K Ohm 10% 1/2W 25(Elec)Turn 2.19mm (9.53 X 4.83 X 11.55mm) Pin Thru-Hole T/R; Manufacturer: Bourns; Manufacturer Part Number: 3296W-1-503RLF; Resistance: 50kR; Power Rating: 500mW; Number of Turns: 25; Temperature Coefficient: 100ppm/°C; Supplier 1: Newark; RoHS: Yes; Category: Variable Resistors and Potentiometers; Stock 1: 677; Pricing 1: 1=3,73000, 10=2,89000, 25=2,82000, 50=2,74000, 100=2,47000 (USD); Mount: Through Hole,Panel; Weight: 0.03oz; Contact Plating: Tin,Matte; Min Operating Temperature: -55°C; Max Operating Temperature: 125°C; Package Quantity: 1000; Tolerance: 10%; Packaging: Tape and Reel; Resistor Type: Cermet; Termination: Pin; Taper: Linear; Max Power Dissipation: 500mW; Series: Trimpot® 3296 - Sealed; Technology: CERMET; Resistance Tolerance: 10%; Length: 9.53mm; Width: 0.19inch; Height: 0.395inch; Depth: 4.83mm; Military Standard: Not; REACH SVHC: No SVHC; RoHS Compliant: Yes; ComponentLink1URL: https://datasheet.ciiva.com/3266/3296-3266526.pdf?src-supplier=Avnet; ComponentLink1Description: https://datasheet.ciiva.com/3266/3296-3266526.pdf?src-supplier=Avnet; Supplier Part Number 1: 41Y1395
X1 = XTAL 32.768KHZ: Crystal 32.7680KHZ 12.5PF Th; Manufacturer: Raltron Electronics; Manufacturer Part Number: R38-32.768-12.5-EXT-5PPM; Supplier 1: Digi-Key; RoHS: Yes; Category: Uncategorized; Stock 1: 9158; Pricing 1: 1=0,16000, 10=0,13800, 50=0,12380, 100=0,11000, 500=0,10450, 1000=0,08800, 2500=0,08250, 5000=0,07975, 10000=0,07700 (USD); Supplier Part Number 1: 2151-R38-32.768-12.5-EXT-5PPM-ND